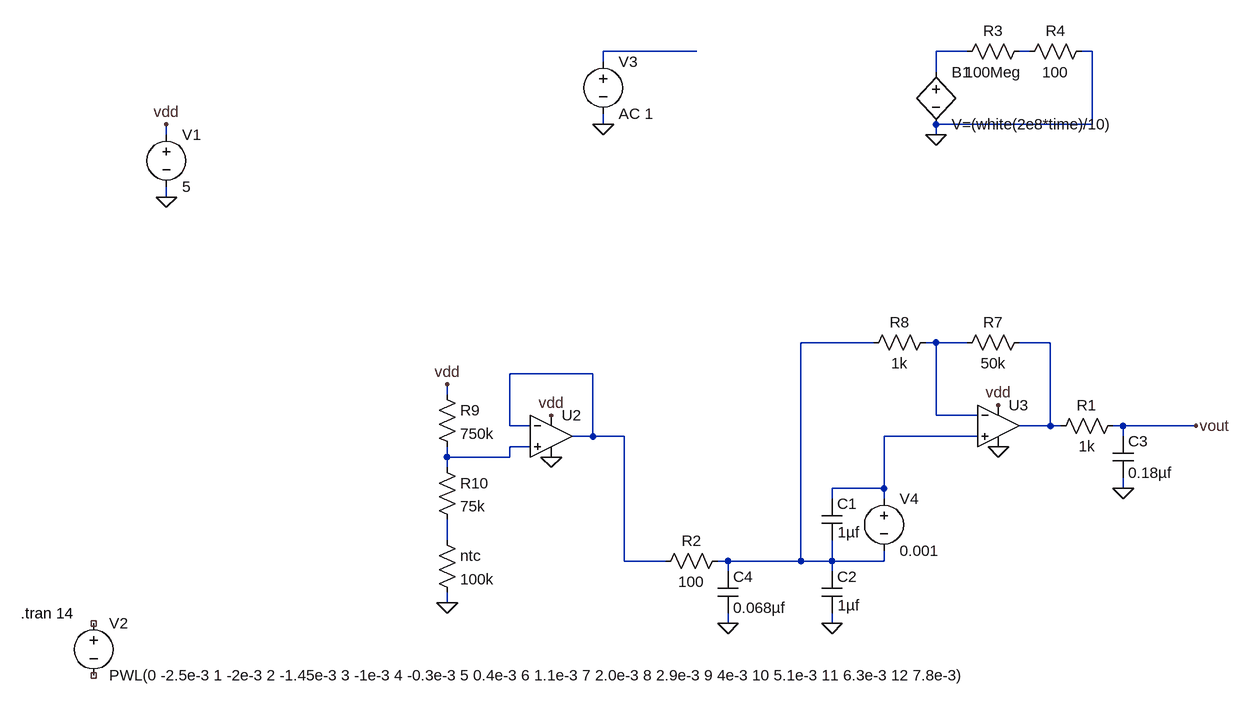
[diagram p0: schematic Temp_Sens_.asc]
Temp_Sens_.asc, the LTspice schematic file:
Version 4
SHEET 1 2584 1028
WIRE 960 -432 816 -432
WIRE 1376 -432 1328 -432
WIRE 1472 -432 1456 -432
WIRE 1568 -432 1552 -432
WIRE 816 -416 816 -432
WIRE 1328 -400 1328 -432
WIRE 816 -320 816 -336
WIRE 1568 -320 1568 -432
WIRE 1568 -320 1328 -320
WIRE 144 -304 144 -320
WIRE 1328 -304 1328 -320
WIRE 144 -208 144 -224
WIRE 1232 16 1120 16
WIRE 1328 16 1312 16
WIRE 1376 16 1328 16
WIRE 1504 16 1456 16
WIRE 800 64 672 64
WIRE 576 96 576 80
WIRE 1328 128 1328 16
WIRE 1392 128 1328 128
WIRE 672 144 672 64
WIRE 704 144 672 144
WIRE 1504 144 1504 16
WIRE 1504 144 1456 144
WIRE 1520 144 1504 144
WIRE 1616 144 1600 144
WIRE 1728 144 1616 144
WIRE 800 160 800 64
WIRE 800 160 768 160
WIRE 848 160 800 160
WIRE 1392 160 1248 160
WIRE 1616 160 1616 144
WIRE 704 176 672 176
WIRE 576 192 576 176
WIRE 672 192 672 176
WIRE 672 192 576 192
WIRE 576 208 576 192
WIRE 1248 240 1248 160
WIRE 1248 240 1168 240
WIRE 1616 240 1616 224
WIRE 1168 256 1168 240
WIRE 1248 256 1248 240
WIRE 576 320 576 288
WIRE 848 352 848 160
WIRE 912 352 848 352
WIRE 1008 352 992 352
WIRE 1120 352 1120 16
WIRE 1120 352 1008 352
WIRE 1168 352 1168 320
WIRE 1168 352 1120 352
WIRE 1248 352 1248 336
WIRE 1248 352 1168 352
WIRE 1008 368 1008 352
WIRE 1168 368 1168 352
WIRE 576 416 576 400
WIRE 1008 448 1008 432
WIRE 1168 448 1168 432
FLAG 144 -208 0
FLAG 144 -320 vdd
FLAG 1424 112 vdd
FLAG 1424 176 0
FLAG 736 128 vdd
FLAG 736 192 0
FLAG 576 80 vdd
FLAG 576 416 0
FLAG 1728 144 vout
FLAG 1168 448 0
FLAG 1616 240 0
FLAG 1008 448 0
FLAG 816 -320 0
FLAG 1328 -304 0
SYMBOL voltage 144 -320 R0
WINDOW 123 0 0 Left 0
WINDOW 39 0 0 Left 0
SYMATTR InstName V1
SYMATTR Value 5
SYMBOL voltage 32 432 R0
WINDOW 123 0 0 Left 0
WINDOW 39 0 0 Left 0
SYMATTR InstName V2
SYMATTR Value PWL(0 -2.5e-3 1 -2e-3 2 -1.45e-3 3 -1e-3 4 -0.3e-3 5 0.4e-3 6 1.1e-3 7 2.0e-3 8 2.9e-3 9 4e-3 10 5.1e-3 11 6.3e-3 12 7.8e-3)
SYMBOL Opamps\\UniversalOpamp2 1424 144 R0
SYMATTR InstName U3
SYMBOL res 1472 0 R90
WINDOW 0 0 56 VBottom 2
WINDOW 3 32 56 VTop 2
SYMATTR InstName R7
SYMATTR Value 50k
SYMBOL res 1328 0 R90
WINDOW 0 0 56 VBottom 2
WINDOW 3 32 56 VTop 2
SYMATTR InstName R8
SYMATTR Value 1k
SYMBOL Opamps\\UniversalOpamp2 736 160 R0
SYMATTR InstName U2
SYMBOL cap 1152 256 R0
WINDOW 3 25 52 Left 2
SYMATTR Value 1µf
SYMATTR InstName C1
SYMATTR SpiceLine V=16
SYMBOL res 560 80 R0
SYMATTR InstName R9
SYMATTR Value 750k
SYMBOL res 560 192 R0
SYMATTR InstName R10
SYMATTR Value 75k
SYMBOL res 560 304 R0
SYMATTR InstName ntc
SYMATTR Value 100k
SYMBOL cap 1152 368 R0
WINDOW 3 25 52 Left 2
SYMATTR Value 1µf
SYMATTR InstName C2
SYMATTR SpiceLine V=16
SYMBOL res 1616 128 R90
WINDOW 0 0 56 VBottom 2
WINDOW 3 32 56 VTop 2
SYMATTR InstName R1
SYMATTR Value 1k
SYMBOL cap 1600 160 R0
SYMATTR InstName C3
SYMATTR Value 0.18µf
SYMBOL res 1008 336 R90
WINDOW 0 0 56 VBottom 2
WINDOW 3 32 56 VTop 2
SYMATTR InstName R2
SYMATTR Value 100
SYMBOL cap 992 368 R0
SYMATTR InstName C4
SYMATTR Value 0.068µf
SYMBOL voltage 816 -432 R0
WINDOW 123 0 0 Left 0
WINDOW 39 0 0 Left 0
SYMATTR InstName V3
SYMATTR Value AC 1
SYMBOL voltage 1248 240 R0
WINDOW 123 0 0 Left 0
WINDOW 39 0 0 Left 0
SYMATTR InstName V4
SYMATTR Value 0.001
SYMBOL bv 1328 -416 R0
SYMATTR InstName B1
SYMATTR Value V=(white(2e8*time)/10)
SYMBOL res 1472 -448 R90
WINDOW 0 0 56 VBottom 2
WINDOW 3 32 56 VTop 2
SYMATTR InstName R3
SYMATTR Value 100Meg
SYMBOL res 1568 -448 R90
WINDOW 0 0 56 VBottom 2
WINDOW 3 32 56 VTop 2
SYMATTR InstName R4
SYMATTR Value 100
TEXT -80 432 Left 2 !.tran 14

The netlist it stands for:
* Temp_Sens_.asc
V1 vdd 0 5
V2 NC_01 NC_02 PWL(0 -2.5e-3 1 -2e-3 2 -1.45e-3 3 -1e-3 4 -0.3e-3 5 0.4e-3 6 1.1e-3 7 2.0e-3 8 2.9e-3 9 4e-3 10 5.1e-3 11 6.3e-3 12 7.8e-3)
XU3 N008 N005 vdd 0 N006 level.2 Avol=1Meg GBW=10Meg Slew=10Meg ilimit=25m rail=0 Vos=0 phimargin=45 en=0 enk=0 in=0 ink=0 Rin=500Meg  ; pins IN+ IN- V+ V- OUT
R7 N006 N005 50k
R8 N005 N004 1k
XU2 N009 N007 vdd 0 N007 level.2 Avol=1Meg GBW=10Meg Slew=10Meg ilimit=25m rail=0 Vos=0 phimargin=45 en=0 enk=0 in=0 ink=0 Rin=500Meg  ; pins IN+ IN- V+ V- OUT
C1 N008 N004 1µf V=16
R9 vdd N009 750k
R10 N009 N010 75k
R§ntc N010 0 100k
C2 N004 0 1µf V=16
R1 vout N006 1k
C3 vout 0 0.18µf
R2 N004 N007 100
C4 N004 0 0.068µf
V3 N001 0 AC 1
V4 N008 N004 0.001
B1 N002 0 V=(white(2e8*time)/10)
R3 N003 N002 100Meg
R4 0 N003 100
.tran 14
.lib UniversalOpamps2.sub
.backanno
.end